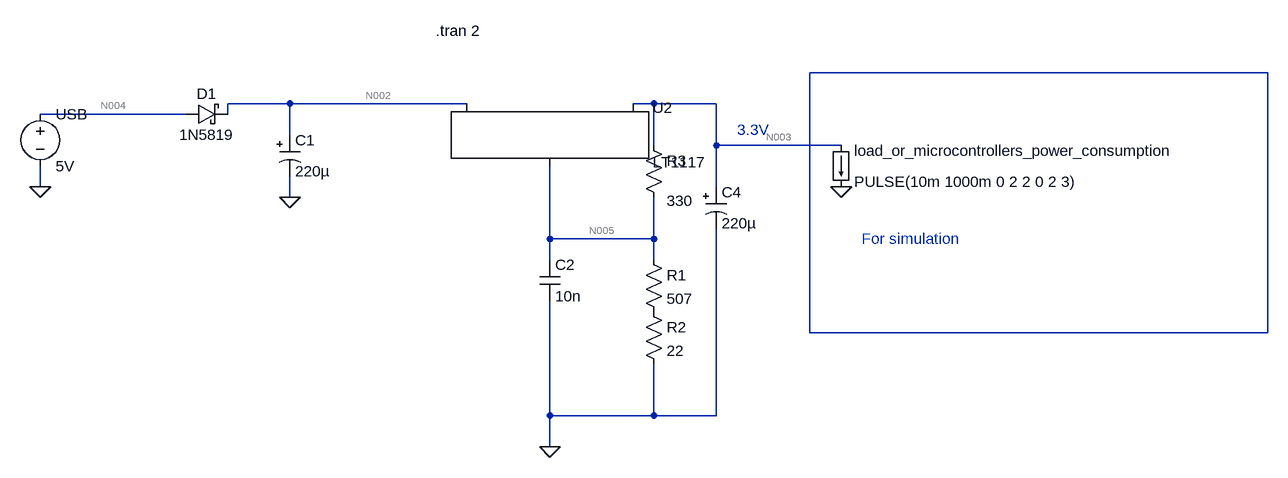
[diagram p0: schematic 3V3 power from USB A to USBC breakout.asc]
3V3 power from USB A to USBC breakout.asc, the LTspice schematic file:
Version 4
SHEET 1 956 740
WIRE -272 16 -976 16
WIRE -1776 64 -1872 64
WIRE -1504 64 -1776 64
WIRE -1216 64 -1248 64
WIRE -1120 64 -1216 64
WIRE -1936 80 -2160 80
WIRE -1872 80 -1872 64
WIRE -1776 112 -1776 64
WIRE -1216 128 -1216 64
WIRE -1120 128 -1120 64
WIRE -928 128 -1120 128
WIRE -2160 192 -2160 160
WIRE -1120 192 -1120 128
WIRE -1776 208 -1776 176
WIRE -1376 272 -1376 160
WIRE -1216 272 -1216 208
WIRE -1216 272 -1376 272
WIRE -1376 304 -1376 272
WIRE -1216 304 -1216 272
WIRE -976 416 -976 16
WIRE -272 416 -272 16
WIRE -272 416 -976 416
WIRE -1376 544 -1376 368
WIRE -1216 544 -1216 464
WIRE -1216 544 -1376 544
WIRE -1120 544 -1120 256
WIRE -1120 544 -1216 544
WIRE -1376 592 -1376 544
FLAG -1376 592 0
FLAG -2160 192 0
FLAG -928 192 0
FLAG -1776 208 0
SYMBOL PowerProducts\\LT1117 -1376 64 R0
SYMATTR InstName U2
SYMBOL voltage -2160 64 R0
WINDOW 123 0 0 Left 0
WINDOW 39 0 0 Left 0
SYMATTR InstName USB
SYMATTR Value 5V
SYMBOL res -1232 112 R0
WINDOW 3 36 101 Left 2
SYMATTR Value 330
SYMATTR InstName R3
SYMBOL cap -1392 304 R0
SYMATTR InstName C2
SYMATTR Value 10n
SYMBOL polcap -1136 192 R0
WINDOW 3 24 56 Left 2
SYMATTR Value 220µ
SYMATTR InstName C4
SYMATTR Description Capacitor
SYMATTR Type cap
SYMATTR SpiceLine V=16 Irms=540m Rser=0.24 Lser=4.5n mfg="Würth Elektronik" pn="860160374017 WCAP-ATLL 8x11,5" type="Al electrolytic"
SYMBOL load -944 128 R0
WINDOW 123 0 0 Left 0
WINDOW 39 0 0 Left 0
SYMATTR InstName load_or_microcontrollers_power_consumption
SYMATTR Value PULSE(10m 1000m 0 2 2 0 2 3)
SYMBOL res -1232 288 R0
SYMATTR InstName R1
SYMATTR Value 507
SYMBOL res -1232 368 R0
SYMATTR InstName R2
SYMATTR Value 22
SYMBOL schottky -1936 96 R270
WINDOW 0 32 32 VTop 2
WINDOW 3 0 32 VBottom 2
SYMATTR InstName D1
SYMATTR Value 1N5819
SYMATTR Description Diode
SYMATTR Type diode
SYMBOL polcap -1792 112 R0
WINDOW 3 24 56 Left 2
SYMATTR Value 220µ
SYMATTR InstName C1
SYMATTR Description Capacitor
SYMATTR Type cap
SYMATTR SpiceLine V=16 Irms=540m Rser=0.24 Lser=4.5n mfg="Würth Elektronik" pn="860160374017 WCAP-ATLL 8x11,5" type="Al electrolytic"
TEXT -1552 -48 Left 2 !.tran 2
TEXT -896 272 Left 2 ;For simulation
TEXT -1088 104 Left 2 ;3.3V

The netlist it stands for:
* 3V3 power from USB A to USBC breakout.asc
XU2 N005 N003 N002 LT1117
V§USB N004 0 5V
R3 N003 N005 330
C2 N005 0 10n
C4 N003 0 220µ V=16 Irms=540m Rser=0.24 Lser=4.5n mfg="Würth Elektronik" pn="860160374017 WCAP-ATLL 8x11,5" type="Al electrolytic"
I§load_or_microcontrollers_power_consumption N003 0 PULSE(10m 1000m 0 2 2 0 2 3)
R1 N005 P001 507
R2 P001 0 22
D1 N004 N002 1N5819
C1 N002 0 220µ V=16 Irms=540m Rser=0.24 Lser=4.5n mfg="Würth Elektronik" pn="860160374017 WCAP-ATLL 8x11,5" type="Al electrolytic"
.model D D
.lib standard.dio
.tran 2
* For simulation
* 3.3V
.lib LT1117.lib
.backanno
.end

* Results of the author's LTspice run, read from the files saved beside the schematic
* Operating Point, zero values left out:
*   V(n002) = 4.783 V
*   V(n005) = 2.047 V
*   V(n003) = 3.306 V
*   V(n004) = 5 V
*   V(p001) = 85.14 mV
*   I(D1) = 13.87 mA
*   I(Load_or_microcontrollers_power_consumption) = 10 mA
*   I(R3) = 3.815 mA
*   I(R1) = 3.87 mA
*   I(R2) = 3.87 mA
*   I(Usb) = -13.87 mA
*   Ix(u2:1) = -54.99 µA
*   Ix(u2:2) = -13.82 mA
*   Ix(u2:3) = 13.87 mA